# Altium schematic sheet orn_proj_complete.SchDoc: Tree Ornament Gift
size A4; DrawnBy: Andrew Kuklinski; Engineer: Andrew Kuklinski; Organization: Personal Project; Revision: v1.0; SheetNumber: 1; SheetTotal: 1
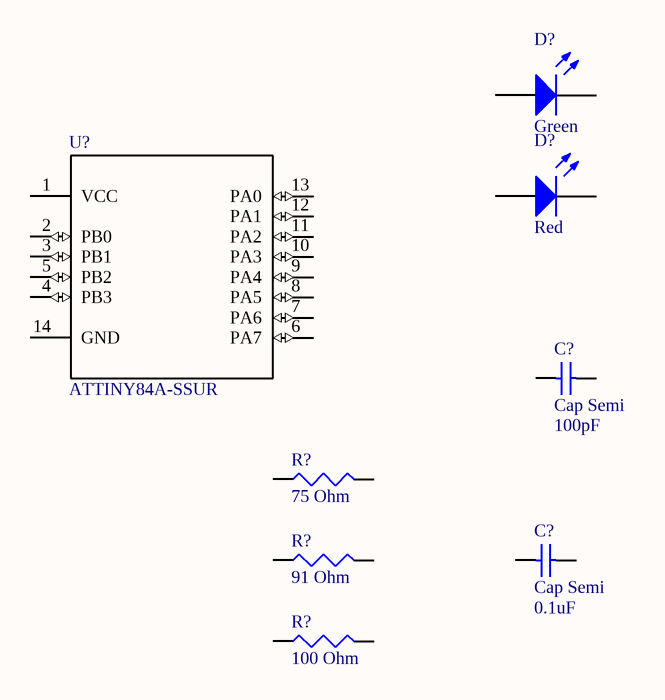
[diagram p0: orn_proj_complete.SchDoc]

## Parts
(Parts that share a designator on the sheet are numbered #1, #2 ... from top to bottom, then left to right.)
C?#1  Cap Semi  value 100pF  [C1206]
C?#2  Cap Semi  value 0.1uF  [C1206]
D?#1  Green  [3.2X1.6X1.1]
D?#2  Red  [3.2X1.6X1.1]
R?#1  value 75 Ohm  [J1-0603]  (hidden comment: Res3)
R?#2  value 91 Ohm  [C0805]  (hidden comment: Res3)
R?#3  value 100 Ohm  [J1-0603]  (hidden comment: Res3)
U?  ATTINY84A-SSUR

## Nets

Not connected (* = marked no-connect by the designer): C?#1 1 2; C?#2 1 2; D?#1 1(A) 2(K); D?#2 1(A) 2(K); R?#1 1 2; R?#2 1 2; R?#3 1 2; U? 1(VCC) 2(PB0) 3(PB1) 4(PB3) 5(PB2) 6(PA7) 7(PA6) 8(PA5) 9(PA4) 10(PA3) 11(PA2) 12(PA1) 13(PA0) 14(GND)

## Notes on the sheet
- Title
- Size:
- Date:
- A4
- Number:
- Time:
- Revision:
- Sheet
- of
- File:

## Library data of the parts
C?#1 = Cap Semi: Capacitor (Semiconductor SIM Model); Published: 8-Jun-2000; LatestRevisionDate: 29-May-2009; LatestRevisionNote: IPC-7351 Footprint Added.; PackageReference: C1206; Publisher: Altium Limited; PackageDescription: Chip Capacitor
C?#2 = Cap_0.1uF: Capacitor (Semiconductor SIM Model); Manufacturer 1: Samsung; Manufacturer Part Number 1: CL21B104JBCNNNC; Material: Ceramic; Voltage Rating: 50V; Capacitance: 100nF; Tolerance: 5%; Dielectric: X7R; Published: 8-Jun-2000; LatestRevisionDate: 29-May-2009; LatestRevisionNote: IPC-7351 Footprint Added.; PackageReference: C1206; Publisher: Altium Limited; PackageDescription: Chip Capacitor; Supplier 1: Digi-Key; Stock 1: 92118; Pricing 1: 1=0.10000, 10=0.07000, 100=0.03130, 500=0.02234, 1000=0.01755 (USD); RoHS: Yes; Mount: Surface Mount; Case/Package: 0805; Contact Plating: Tin; Case Code (Metric): 2012; Case Code (Imperial): 0805; Min Operating Temperature: -55°C; Max Operating Temperature: 125°C; Package Quantity: 1; Packaging: Tape and Reel; Voltage: 50V; Length: 2mm; Height: 0.85mm; Width: 0.049inch; Thickness: 0.037inch; Depth: 1.25mm; Radiation Hardening: No; ComponentLink1URL: https://datasheet.ciiva.com/25799/cl21b104jbcnnnc-25799232.pdf?src-supplier=Digi-Key; ComponentLink1Description: https://datasheet.ciiva.com/25799/cl21b104jbcnnnc-25799232.pdf?src-supplier=Digi-Key; ComponentLink2URL: https://datasheet.ciiva.com/26838/getdatasheetpartid-354073-26838656.pdf?src-supplier=Verical; ComponentLink2Description: https://datasheet.ciiva.com/26838/getdatasheetpartid-354073-26838656.pdf?src-supplier=Verical; ComponentLink3URL: https://datasheet.ciiva.com/29199/454108-da-01-en-vs-kondensator-0805-29199802.pdf?src-supplier=Conrad; ComponentLink3Description: https://datasheet.ciiva.com/29199/454108-da-01-en-vs-kondensator-0805-29199802.pdf?src-supplier=Conrad; ComponentLink4URL: https://datasheet.ciiva.com/16508/hsm00000015872757-16508637.pdf?src-supplier=Future+Electronics; ComponentLink4Description: https://datasheet.ciiva.com/16508/hsm00000015872757-16508637.pdf?src-supplier=Future+Electronics; Supplier Part Number 1: 1276-1090-1-ND
D?#1 = LED_Green: Typical RED, GREEN, YELLOW, AMBER GaAs LED; Manufacturer 1: Wurth Electronics; Manufacturer Part Number 1: 150080VS75000; Luminous Intensity: 40mcd; Forward Current: 30mA; Forward Voltage: 2V; Viewing Angle: 140°; Wavelength: 570nm; Lens Style: Clear,Rectangular; Test Current: 20mA; Description: WURTH ELEKTRONIK   150080VS75000   LED, 0805, B GREEN, 40MCD, 570NM; Published: 8-Jun-2000; LatestRevisionDate: 17-Jul-2002; LatestRevisionNote: Re-released for DXP Platform.; PackageVersion: Feb-2002; PackageReference: 3.2X1.6X1.1; Publisher: Altium Limited; PackageDescription: SM LED; 2 Flat Leads; Supplier 1: Digi-Key; Stock 1: 48000; Pricing 1: 4000=0.12300 (USD); RoHS: Yes; Mount: Surface Mount; Case/Package: 0805; Color: Green; Case Code (Metric): 2012; Case Code (Imperial): 0805; Min Operating Temperature: -40°C; Max Operating Temperature: 85°C; Package Quantity: 4000; Packaging: Tape and Reel; Dominant Wavelength: 570nm; Length: 2mm; Height: 0.7mm; Width: 1.25mm; REACH SVHC: Unknown; ComponentLink1URL: https://datasheet.ciiva.com/22656/150080vs75000-22656966.pdf?src-supplier=Element14; ComponentLink1Description: https://datasheet.ciiva.com/22656/150080vs75000-22656966.pdf?src-supplier=Element14; ComponentLink2URL: https://datasheet.ciiva.com/29279/759437-da-01-en-chipled-0805-w-kl-h-gruen-150080vs7500-29279047.pdf?src-supplier=Conrad; ComponentLink2Description: https://datasheet.ciiva.com/29279/759437-da-01-en-chipled-0805-w-kl-h-gruen-150080vs7500-29279047.pdf?src-supplier=Conrad; ComponentLink3URL: https://datasheet.ciiva.com/29563/150080vs75000-29563018.pdf?src-supplier=Digi-Key; ComponentLink3Description: https://datasheet.ciiva.com/29563/150080vs75000-29563018.pdf?src-supplier=Digi-Key; Supplier Part Number 1: 732-4986-2-ND
D?#2 = LED_Red: Typical RED, GREEN, YELLOW, AMBER GaAs LED; Manufacturer 1: Wurth Electronics; Manufacturer Part Number 1: 150080VS75000; Luminous Intensity: 40mcd; Forward Current: 30mA; Forward Voltage: 2V; Viewing Angle: 140°; Wavelength: 570nm; Lens Style: Clear,Rectangular; Test Current: 20mA; Published: 8-Jun-2000; LatestRevisionDate: 17-Jul-2002; LatestRevisionNote: Re-released for DXP Platform.; PackageVersion: Feb-2002; PackageReference: 3.2X1.6X1.1; Publisher: Altium Limited; PackageDescription: SM LED; 2 Flat Leads; Supplier 1: Digi-Key; Stock 1: 48000; Pricing 1: 4000=0.12300 (USD); RoHS: Yes; Mount: Surface Mount; Case/Package: 0805; Color: Green; Case Code (Metric): 2012; Case Code (Imperial): 0805; Min Operating Temperature: -40°C; Max Operating Temperature: 85°C; Package Quantity: 4000; Packaging: Tape and Reel; Dominant Wavelength: 570nm; Length: 2mm; Height: 0.7mm; Width: 1.25mm; REACH SVHC: Unknown; ComponentLink1URL: https://datasheet.ciiva.com/22656/150080vs75000-22656966.pdf?src-supplier=Element14; ComponentLink1Description: https://datasheet.ciiva.com/22656/150080vs75000-22656966.pdf?src-supplier=Element14; ComponentLink2URL: https://datasheet.ciiva.com/29279/759437-da-01-en-chipled-0805-w-kl-h-gruen-150080vs7500-29279047.pdf?src-supplier=Conrad; ComponentLink2Description: https://datasheet.ciiva.com/29279/759437-da-01-en-chipled-0805-w-kl-h-gruen-150080vs7500-29279047.pdf?src-supplier=Conrad; ComponentLink3URL: https://datasheet.ciiva.com/29563/150080vs75000-29563018.pdf?src-supplier=Digi-Key; ComponentLink3Description: https://datasheet.ciiva.com/29563/150080vs75000-29563018.pdf?src-supplier=Digi-Key; Supplier Part Number 1: 732-4986-2-ND; Supplier 2: Digi-Key; Manufacturer 2: SunLED; Manufacturer Part Number 2: XZMDK54W-8; Stock 2: 2620; Pricing 2: 1=0.49000, 10=0.34700, 100=0.20210, 500=0.13860, 1000=0.11550 (USD); ComponentLink4URL: http://www.sunledusa.com/products/spec/XZMDK54W-8.pdf?src-supplier=Digi-Key; ComponentLink4Description: http://www.sunledusa.com/products/spec/XZMDK54W-8.pdf?src-supplier=Digi-Key; Supplier Part Number 2: 1497-1431-1-ND
R?#1 = Res_75_Ohm: Resistor; Manufacturer 1: Stackpole Electronics; Manufacturer Part Number 1: RNCP0805FTD75R0; Resistance: 75R; Tolerance: 1%; Max Power Dissipation: 250mW; Temperature Coefficient: 100ppm/°C; Published: 8-Jun-2000; LatestRevisionDate: 29-May-2009; LatestRevisionNote: IPC-7351 Footprint Added.; PackageReference: J1-0603; Publisher: Altium Limited; PackageDescription: Chip Resistor; Supplier 1: Digi-Key; Stock 1: 16930; Pricing 1: 1=0.10000, 10=0.07200, 100=0.02770, 1000=0.01220, 2500=0.01053 (USD); RoHS: Yes; Mount: Surface Mount; Case/Package: 0805; Case Code (Metric): 2012; Case Code (Imperial): 0805; Min Operating Temperature: -55°C; Max Operating Temperature: 155°C; Packaging: Tape and Reel; Composition: Thin Film; Number of Terminations: 2; Features: Moisture Resistant,Anti-Sulfur; Length: 0.079inch; Height: 0.024inch; Width: 0.049inch; ComponentLink1URL: http://www.seielect.com/Catalog/SEI-rncp.pdf?src-supplier=Digi-Key; ComponentLink1Description: http://www.seielect.com/Catalog/SEI-rncp.pdf?src-supplier=Digi-Key; ComponentLink2URL: https://www.seielect.com/catalog/SEI-Packaging.pdf?src-supplier=Digi-Key; ComponentLink2Description: https://www.seielect.com/catalog/SEI-Packaging.pdf?src-supplier=Digi-Key; Supplier Part Number 1: RNCP0805FTD75R0CT-ND
R?#2 = Res_91_ohm: Resistor; Manufacturer 1: KOA Speer; Manufacturer Part Number 1: RK73B2ATTD910J; Resistance: 91R; Tolerance: 5%; Power Rating: 125mW; Voltage Rating: 150V; Temperature Coefficient: 200ppm/°C; Published: 8-Jun-2000; LatestRevisionDate: 29-May-2009; LatestRevisionNote: IPC-7351 Footprint Added.; PackageReference: J1-0603; Publisher: Altium Limited; PackageDescription: Chip Resistor; Supplier 1: Digi-Key; Stock 1: 9945; Pricing 1: 1=0.10000, 10=0.02800, 100=0.01160, 1000=0.00520, 2500=0.00452 (USD); RoHS: Yes; Case/Package: 0805; Case Code (Imperial): 0805; Case Code (Metric): 2012; Min Operating Temperature: -55°C; Max Operating Temperature: 155°C; Packaging: Tape and Reel; Package Quantity: 5000; Composition: Thick Film; Termination: SMD/SMT; Military Standard: Not; Voltage Rating (DC): 150V; Length: 2mm; Height: 0.5mm; Width: 1.25mm; Depth: 1.25mm; Lead Free: Lead Free; ComponentLink1URL: http://www.koaspeer.com/catimages/Products/RK73B/RK73B.pdf?src-supplier=Mouser; ComponentLink1Description: http://www.koaspeer.com/catimages/Products/RK73B/RK73B.pdf?src-supplier=Mouser; Supplier Part Number 1: 2019-RK73B2ATTD910JCT-ND
R?#3 = Res_100_Ohm: Resistor; Manufacturer 1: Stackpole Electronics; Manufacturer Part Number 1: RNCP0805FTD100R; Resistance: 100R; Tolerance: 1%; Max Power Dissipation: 250mW; Temperature Coefficient: 100ppm/°C; Published: 8-Jun-2000; LatestRevisionDate: 29-May-2009; LatestRevisionNote: IPC-7351 Footprint Added.; PackageReference: J1-0603; Publisher: Altium Limited; PackageDescription: Chip Resistor; Supplier 1: Digi-Key; Stock 1: 253189; Pricing 1: 1=0.10000, 10=0.07200, 100=0.02770, 1000=0.01220, 2500=0.01053 (USD); RoHS: Yes; Mount: Surface Mount; Case/Package: 0805; Case Code (Metric): 2012; Case Code (Imperial): 0805; Min Operating Temperature: -55°C; Max Operating Temperature: 155°C; Packaging: Tape and Reel; Composition: Thin Film; Number of Terminations: 2; Features: Moisture Resistant,Anti-Sulfur; Length: 0.079inch; Height: 0.024inch; Width: 0.049inch; Lead Free: Lead Free; ComponentLink1URL: http://www.seielect.com/Catalog/SEI-rncp.pdf?src-supplier=Digi-Key; ComponentLink1Description: http://www.seielect.com/Catalog/SEI-rncp.pdf?src-supplier=Digi-Key; ComponentLink2URL: https://www.seielect.com/catalog/SEI-Packaging.pdf?src-supplier=Digi-Key; ComponentLink2Description: https://www.seielect.com/catalog/SEI-Packaging.pdf?src-supplier=Digi-Key; Supplier Part Number 1: RNCP0805FTD100RCT-ND
U? = ATTINY84A-SSUR: IC MCU 8BIT 8KB FLASH 14SOIC; Manufacturer 1: Microchip / Atmel; Data Bus Width: 8b; Core Architecture: AVR; RAM Size: 512B; Interface: SPI; Number of I/Os: 12; Number of Timers/Counters: 2; Frequency: 20MHz; Max Supply Voltage: 5.5V; Min Supply Voltage: 1.8V; Oscillator Type: Internal; Watchdog Timer: Yes; Peripherals: Brown-out Detect/Reset,POR,PWM,WDT,Temp Sensor; Supplier 1: Digi-Key; Manufacturer Part Number 1: ATTINY84A-SSUR; Stock 1: 10698; Pricing 1: 1=0.82000, 25=0.75000, 100=0.68000 (USD); RoHS: Yes; Mount: Surface Mount; Case/Package: SOIC; Number of Pins: 14; Contact Plating: Tin,Matte; Min Operating Temperature: -40°C; Max Operating Temperature: 85°C; Package Quantity: 3000; Packaging: Tape and Reel; Number of Programmable I/O: 12; Max Frequency: 20MHz; Memory Type: FLASH; Memory Size: 8KB; Radiation Hardening: No; Lead Free: Lead Free; ComponentLink1URL: https://datasheet.ciiva.com/1554/8183s-1554784.pdf?src-supplier=Avnet; ComponentLink1Description: https://datasheet.ciiva.com/1554/8183s-1554784.pdf?src-supplier=Avnet; ComponentLink2URL: https://datasheet.ciiva.com/1554/8183s-1554944.pdf?src-supplier=Digi-Key; ComponentLink2Description: https://datasheet.ciiva.com/1554/8183s-1554944.pdf?src-supplier=Digi-Key; ComponentLink3URL: https://datasheet.ciiva.com/1554/8183s-1554946.pdf?src-supplier=Digi-Key; ComponentLink3Description: https://datasheet.ciiva.com/1554/8183s-1554946.pdf?src-supplier=Digi-Key; ComponentLink4URL: https://datasheet.ciiva.com/1554/8183s-1554945.pdf?src-supplier=Digi-Key; ComponentLink4Description: https://datasheet.ciiva.com/1554/8183s-1554945.pdf?src-supplier=Digi-Key; Supplier Part Number 1: ATTINY84A-SSURCT-ND